# Altium schematic sheet ESC.SchDoc
size A4
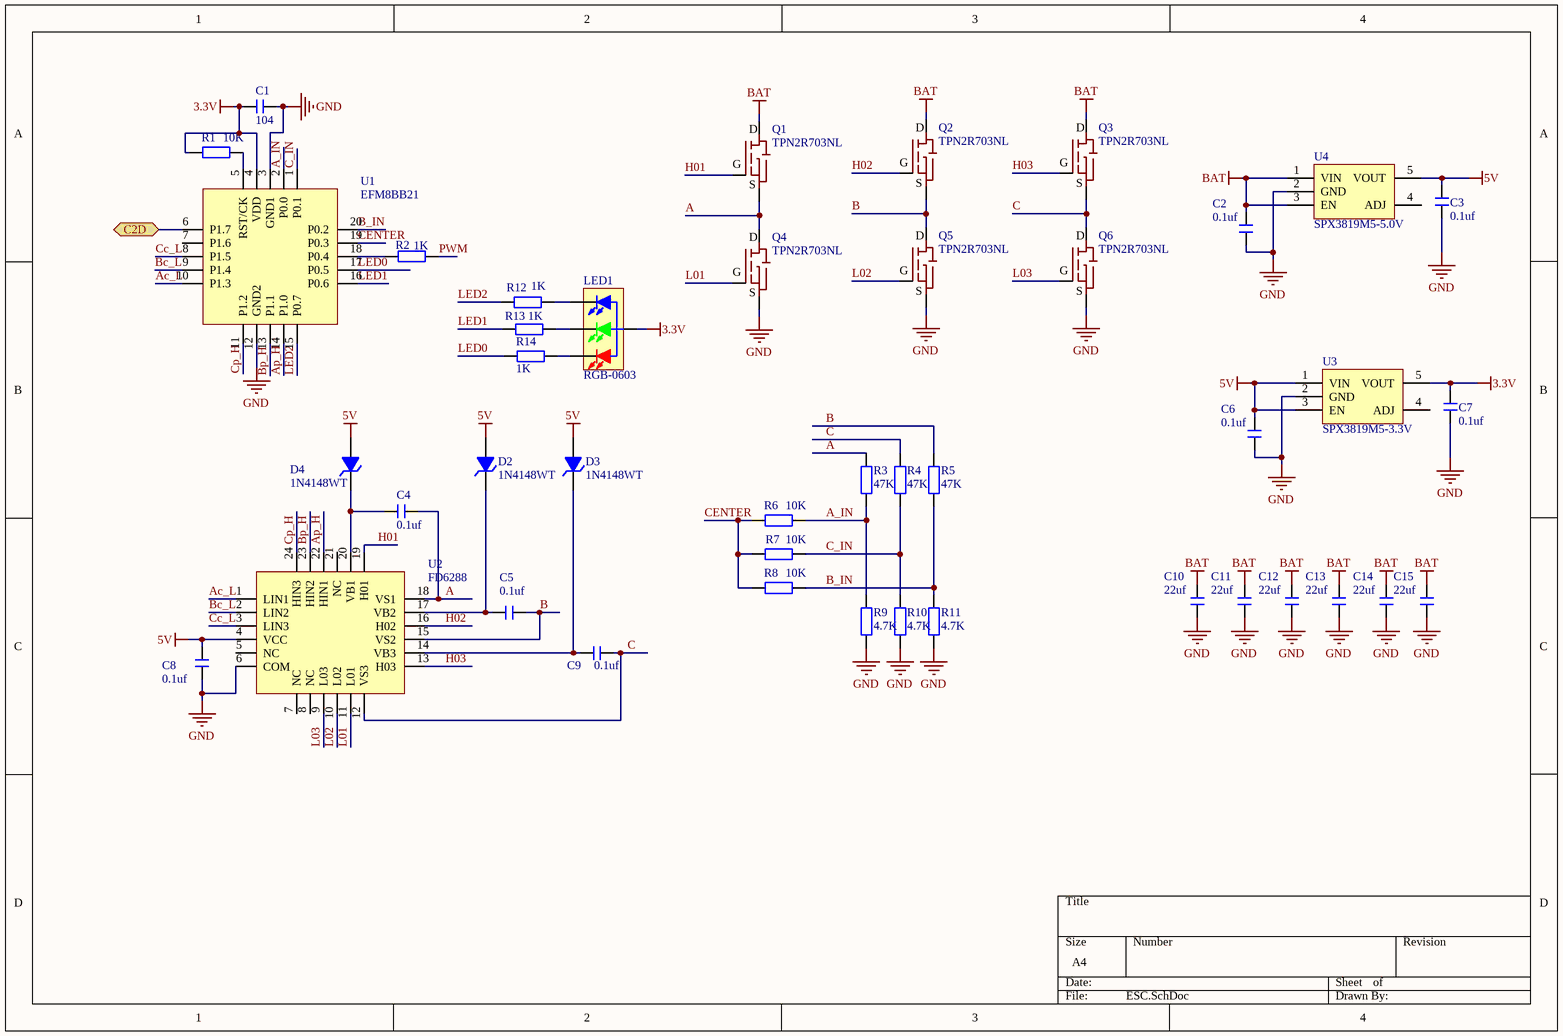
[diagram p0: ESC.SchDoc]

## Parts
C1  104  [0402-C-1.6*0.5]
C2  0.1uf  [0402-C-1.6*0.5]
C3  0.1uf  [0402-C-1.6*0.5]
C4  0.1uf  [0402-C-1.6*0.5]
C5  0.1uf  [0402-C-1.6*0.5]
C6  0.1uf  [0402-C-1.6*0.5]
C7  0.1uf  [0402-C-1.6*0.5]
C8  0.1uf  [0402-C-1.6*0.5]
C9  0.1uf  [0402-C-1.6*0.5]
C10  22uf  [0805-C-3.0*1.4]
C11  22uf  [0805-C-3.0*1.4]
C12  22uf  [0805-C-3.0*1.4]
C13  22uf  [0805-C-3.0*1.4]
C14  22uf  [0805-C-3.0*1.4]
C15  22uf  [0805-C-3.0*1.4]
D2  1N4148WT  [L_SOD523]
D3  1N4148WT  [L_SOD523]
D4  1N4148WT  [L_SOD523]
LED1  RGB-0603  [LC-0603_Rx2]
Q1  TPN2R703NL  [8-PowerVDFN]
Q2  TPN2R703NL  [8-PowerVDFN]
Q3  TPN2R703NL  [8-PowerVDFN]
Q4  TPN2R703NL  [8-PowerVDFN]
Q5  TPN2R703NL  [8-PowerVDFN]
Q6  TPN2R703NL  [8-PowerVDFN]
R1  10K  [0402-R-1.6*0.5]
R2  1K  [0402-R-1.6*0.5]
R3  47K  [0402-R-1.6*0.5]
R4  47K  [0402-R-1.6*0.5]
R5  47K  [0402-R-1.6*0.5]
R6  10K  [0402-R-1.6*0.5]
R7  10K  [0402-R-1.6*0.5]
R8  10K  [0402-R-1.6*0.5]
R9  4.7K  [0402-R-1.6*0.5]
R10  4.7K  [0402-R-1.6*0.5]
R11  4.7K  [0402-R-1.6*0.5]
R12  1K  [0402-R-1.6*0.5]
R13  1K  [0402-R-1.6*0.5]
R14  1K  [0402-R-1.6*0.5]
U1  EFM8BB21  [EFM8BB21F16G-C-QFN20]
U2  FD6288  [LC-QFN-24_4x4x05P]
U3  SPX3819M5-3.3V  [L - SOT23-5L]
U4  SPX3819M5-5.0V  [L - SOT23-5L]

## Ports
C2D

## Nets
3.3V: C1.2 C7.2 LED1.4(A) R1.1 U1.4(VDD) U3.5(VOUT)
5V: C3.2 C6.2 C8.2 D2.1(A) D3.1(A) D4.1(A) U2.4(VCC) U3.1(VIN) U3.3(EN) U4.5(VOUT)
BAT: C2.2 C10.2 C11.2 C12.2 C13.2 C14.2 C15.2 Q1.3 Q2.3 Q3.3 U4.1(VIN) U4.3(EN)
GND: C1.1 C2.1 C3.1 C6.1 C7.1 C8.1 C10.1 C11.1 C12.1 C13.1 C14.1 C15.1 Q4.1 Q5.1 Q6.1 R9.2 R10.2 R11.2 U1.3(GND1) U1.12(GND2) U2.6(COM) U3.2(GND) U4.2(GND)
A: C4.2 Q1.1 Q4.3 R3.1 U2.18(VS1)
A_IN: R3.2 R6.2 R9.1 U1.2(P0.0)
Ac_L: U1.10(P1.3) U2.1(LIN1)
Ap_H: U1.14(P1.0) U2.22(HIN1)
B: C5.2 Q2.1 Q5.3 R5.1 U2.15(VS2)
B_IN: R5.2 R8.2 R11.1 U1.20(P0.2)
Bc_L: U1.9(P1.4) U2.2(LIN2)
Bp_H: U1.13(P1.1) U2.23(HIN2)
C: C9.2 Q3.1 Q6.3 R4.1 U2.12(VS3)
C2D: U1.6(P1.7) ; port C2D
C_IN: R4.2 R7.2 R10.1 U1.1(P0.1)
Cc_L: U1.8(P1.5) U2.3(LIN3)
CENTER: R6.1 R7.1 R8.1 U1.19(P0.3)
Cp_H: U1.11(P1.2) U2.24(HIN3)
H01: Q1.2 U2.19(H01)
H02: Q2.2 U2.16(H02)
H03: Q3.2 U2.13(H03)
L01: Q4.2 U2.11(L01)
L02: Q5.2 U2.10(L02)
L03: Q6.2 U2.9(L03)
LED0: R14.1 U1.17(P0.5)
LED1: R13.1 U1.16(P0.6)
LED2: R12.1 U1.15(P0.7)
PWM: R2.1
NetC4_1: C4.1 D4.2(K) U2.20(VB1)
NetC5_1: C5.1 D2.2(K) U2.17(VB2)
NetC9_1: C9.1 D3.2(K) U2.14(VB3)
NetLED1_1: LED1.1(RED_K) R14.2
NetLED1_2: LED1.2(GREEN_K) R13.2
NetLED1_3: LED1.3(BULE_K) R12.2
NetR1_2: R1.2 U1.5(RST/CK)
NetR2_2: R2.2 U1.18(P0.4)

Not connected (* = marked no-connect by the designer): U1 7(P1.6); U2 5(NC) 7(NC) 8(NC) 21(NC); U3 4(ADJ); U4 4(ADJ)

## Notes on the sheet
- (in symbol TPN2R703NL) D; G; S

## Library data of the parts
C1 = C: 无极性贴片电容; 版权归属: 源创客; BOM名称: 无极性贴片电容; 学习资源: www.ooocke.com
C2-C15 = C
LED1 = LED-RGB-3528: 三基色LED; 版权归属: 源创客; BOM名称: 三基色LED; 学习资源: www.ooocke.com
R1 R3-R14 = R
R2 = R: 贴片电阻; 版权归属: 源创客; BOM名称: 贴片电阻; 学习资源: www.ooocke.com
U3 U4 = SPX3819M5: 元件名称: SPX3819M5稳压器; 版权所有: Ly